# EAGLE schematic MICHA (EAGLE 9.2.2)
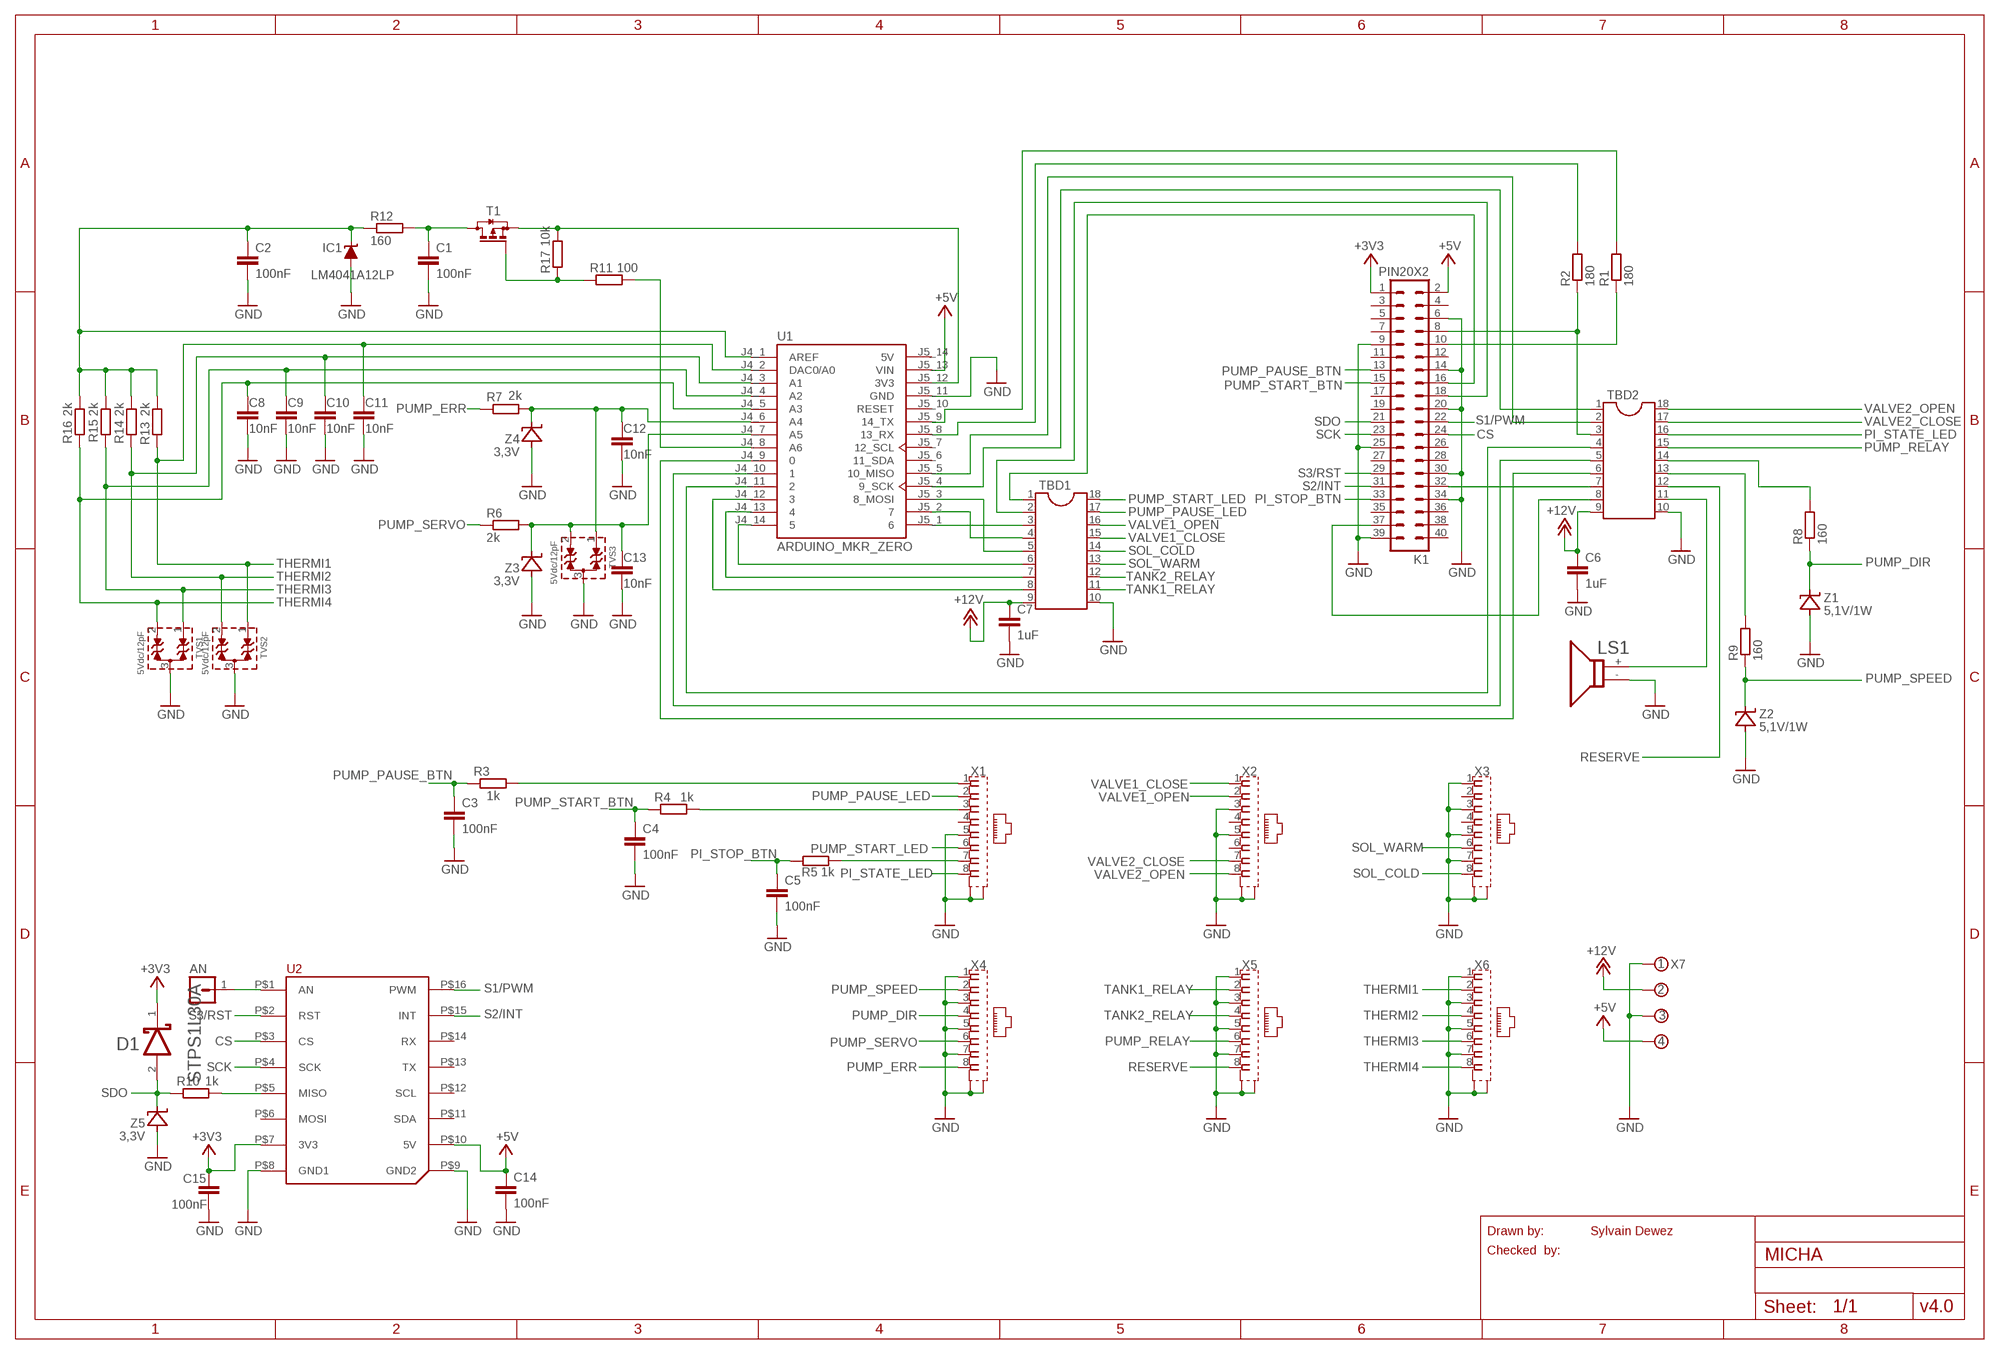
[diagram p0: schematic, sheet 1]

## Parts
AN  MA01_PINHEADER  [MA01]
C1  100nF  C-EUC1206  [C1206]
C2  100nF  C-EUC1206  [C1206]
C3  100nF  C-EUC1206  [C1206]
C4  100nF  C-EUC1206  [C1206]
C5  100nF  C-EUC1206  [C1206]
C6  1uF  C-EUC1206  [C1206]
C7  1uF  C-EUC1206  [C1206]
C8  10nF  C-EUC1206  [C1206]
C9  10nF  C-EUC1206  [C1206]
C10  10nF  C-EUC1206  [C1206]
C11  10nF  C-EUC1206  [C1206]
C12  10nF  C-EUC1206  [C1206]
C13  10nF  C-EUC1206  [C1206]
C14  100nF  C-EUC1206  [C1206]
C15  100nF  C-EUC1206  [C1206]
D1  STMICROELECTRONICS_STPS1L30ASTMICROELECTRONICS_STPS1L30A_0_0  [STMICROELECTRONICS_STPS1L30A_0]
IC1  LM4041A12LP  [LP_O-PBCY-W3]
K1  PIN20X2  [PIN_20X2]
LS1  RSPRO-BUZZER-7800743  [RSPRO-BUZZER-7800743]
R1  180  R-EU_R1206  [R1206]
R2  180  R-EU_R1206  [R1206]
R3  1k  R-EU_R1206  [R1206]
R4  1k  R-EU_R1206  [R1206]
R5  1k  R-EU_R1206  [R1206]
R6  2k  R-EU_R1206  [R1206]
R7  2k  R-EU_R1206  [R1206]
R8  160  R-EU_R1210  [R1210]
R9  160  R-EU_R1210  [R1210]
R10  1k  R-EU_R1206  [R1206]
R11  100  R-EU_R1206  [R1206]
R12  160  R-EU_R1210  [R1210]
R13  2k  R-EU_R1206  [R1206]
R14  2k  R-EU_R1206  [R1206]
R15  2k  R-EU_R1206  [R1206]
R16  2k  R-EU_R1206  [R1206]
R17  10k  R-EU_R1206  [R1206]
T1  BSS84  [SOT23]
TBD1  DIL18S  [SOCKET-18]
TBD2  DIL18S  [SOCKET-18]
TVS1  5Vdc/12pF  WE-TVS_SOT23-3L_824022  [WE-TVS_SOT23-3L]
TVS2  5Vdc/12pF  WE-TVS_SOT23-3L_824022  [WE-TVS_SOT23-3L]
TVS3  5Vdc/12pF  WE-TVS_SOT23-3L_824022  [WE-TVS_SOT23-3L]
U1  ARDUINO_MKR_ZERO  [MODULE_ARDUINO_MKR_ZERO]
U2  MIKROE_CLICK  [MIKROE_BUS_MIDI_NOLABEL]
X1  RJ45-RJULE4318101  [RJ45-RJULE4318101]
X2  RJ45-RJULE4318101  [RJ45-RJULE4318101]
X3  RJ45-RJULE4318101  [RJ45-RJULE4318101]
X4  RJ45-RJULE4318101  [RJ45-RJULE4318101]
X5  RJ45-RJULE4318101  [RJ45-RJULE4318101]
X6  RJ45-RJULE4318101  [RJ45-RJULE4318101]
X7  BUCHANAN_4_3.5MM  [BUCHANAN_4_3.5MM]
Z1  5,1V/1W  ZENER_SMA  [ZENER_SMA]
Z2  5,1V/1W  ZENER_SMA  [ZENER_SMA]
Z3  3,3V  ZENER_SMA  [ZENER_SMA]
Z4  3,3V  ZENER_SMA  [ZENER_SMA]
Z5  3,3V  ZENER_SMA  [ZENER_SMA]

## Nets
+3V3: C15.1 D1.1(CATHODE) K1.1 U2.P$7(3V3)
+5V: C14.1 K1.2 U1.J5_13(VIN) U2.P$10(5V) X7.4(KL3)
+12V: C6.1 C7.1 TBD1.9 TBD2.9 X7.2(KL1)
AN: AN.1 U2.P$1(AN)
CS: K1.24 U2.P$3(CS)
D0: TBD2.6 U1.J4_9
D1: TBD2.5 U1.J4_10
D2: TBD2.4 U1.J4_11
D3: TBD1.8 U1.J4_12
D4: TBD1.7 U1.J4_13
D5: TBD1.6 U1.J4_14
D6: TBD1.3 U1.J5_1
D7: TBD1.4 U1.J5_2
D8: TBD1.5 U1.J5_3(8_MOSI)
D9: TBD2.1 U1.J5_4(9_SCK)
D10: TBD2.2 U1.J5_5(10_MISO)
D19: C12.1 R7.2 TVS3.1(I/O1) U1.J4_6(A4) Z4.C
D21: R11.2 U1.J4_8(A6)
GND: C1.2 C2.2 C3.2 C4.2 C5.2 C6.2 C7.2 C8.2 C9.2 C10.2 C11.2 C12.2 C13.2 C14.2 C15.2 IC1.3(A) K1.6 K1.9 K1.14 K1.20 K1.25 K1.30 K1.34 K1.39 LS1.- TBD1.10 TBD2.10 TVS1.3(GND) TVS2.3(GND) TVS3.3(GND) U1.J5_11(GND) U2.P$8(GND1) U2.P$9(GND2) X1.5 X1.GND1 X1.GND2 X2.3 X2.5 X2.GND1 X2.GND2 X3.1 X3.3 X3.5 X3.7 X3.GND1 X3.GND2 X4.1 X4.3 X4.5 X4.7 X4.GND1 X4.GND2 X5.1 X5.3 X5.5 X5.7 X5.GND1 X5.GND2 X6.1 X6.3 X6.5 X6.7 X6.GND1 X6.GND2 X7.1(KL) X7.3(KL2) Z1.A Z2.A Z3.A Z4.A Z5.A
MISO: R10.2 U2.P$5(MISO)
N$1: R17.2 T1.2(S) U1.J5_12(3V3)
N$2: R8.2 TBD2.14
N$3: R11.1 R17.1 T1.1(G)
N$4: R9.2 TBD2.13
N$5: R4.2 X1.3
N$6: C2.1 IC1.2(C) R12.1 R13.1 R14.1 R15.1 R16.1 U1.J4_1(AREF)
N$14: C13.1 R6.2 TVS3.2(I/O2) U1.J4_7(A5) Z3.C
N$20: C1.1 R12.2 T1.3(D)
N$23: R3.2 X1.1
N$24: R5.2 X1.7
N$26: LS1.+ TBD2.11
PI16: K1.16 TBD1.1
PI18: K1.18 TBD1.2
PI32: K1.32 TBD2.7
PI33: K1.37 TBD2.8
PI_STATE_LED: TBD2.16 X1.8
PI_STOP_BTN: C5.1 K1.33 R5.1
PUMP_DIR: R8.1 X4.4 Z1.C
PUMP_ERR: R7.1 X4.8
PUMP_PAUSE_BTN: C3.1 K1.13 R3.1
PUMP_PAUSE_LED: TBD1.17 X1.2
PUMP_RELAY: TBD2.15 X5.6
PUMP_SERVO: R6.1 X4.6
PUMP_SPEED: R9.1 X4.2 Z2.C
PUMP_START_BTN: C4.1 K1.15 R4.1
PUMP_START_LED: TBD1.18 X1.6
RESERVE: TBD2.12 X5.8
RX_A: R2.2 U1.J5_8(13_RX)
RX_PI: K1.10 R1.1
S1/PWM: K1.22 U2.P$16(PWM)
S2/INT: K1.31 U2.P$15(INT)
S3/RST: K1.29 U2.P$2(RST)
SCK: K1.23 U2.P$4(SCK)
SDO: D1.2(ANODE) K1.21 R10.1 Z5.C
SOL_COLD: TBD1.14 X3.8
SOL_WARM: TBD1.13 X3.6
TANK1_RELAY: TBD1.11 X5.2
TANK2_RELAY: TBD1.12 X5.4
THERMI1: C11.1 R13.2 TVS2.1(I/O1) U1.J4_2(DAC0/A0) X6.2
THERMI2: C10.1 R14.2 TVS2.2(I/O2) U1.J4_3(A1) X6.4
THERMI3: C9.1 R15.2 TVS1.1(I/O1) U1.J4_4(A2) X6.6
THERMI4: C8.1 R16.2 TVS1.2(I/O2) U1.J4_5(A3) X6.8
TX_A: R1.2 U1.J5_9(14_TX)
TX_PI: K1.8 R2.1 TBD2.3
VALVE1_CLOSE: TBD1.15 X2.1
VALVE1_OPEN: TBD1.16 X2.2
VALVE2_CLOSE: TBD2.17 X2.7
VALVE2_OPEN: TBD2.18 X2.8
Unconnected: K1.3 K1.4 K1.5 K1.7 K1.11 K1.12 K1.17 K1.19 K1.26 K1.27 K1.28 K1.35 K1.36 K1.38 K1.40 U1.J5_6(11_SDA) U1.J5_7(12_SCL) U1.J5_10(RESET) U2.P$6(MOSI) U2.P$11(SDA) U2.P$12(SCL) U2.P$13(TX) U2.P$14(RX) X1.4 X2.4 X2.6 X3.2 X3.4

## Notes on the sheet
- Drawn by: | Sylvain Dewez
- Checked  by:
- v4.0

## Power pins joined to a net without a drawn wire
5V: U1.J5_14(5V)

## Library data of the parts
AN = MA01_pinHeader:MA01_PINHEADER
C1-C15 = rcl:C-EU: CAPACITOR, European symbol; SPICEPREFIX: C
D1 = Diode_STPS1L30A:STMICROELECTRONICS_STPS1L30A: LOW DROP POWER SCHOTTKY RECTIFIER; CENTROID_NOT_SPECIFIED: No; DATASHEET: http://www.st.com/content/ccc/resource/technical/document/datasheet/d4/83/f4/ff/dc/cc/48/7f/CD00001323.pdf/files/CD00001323.pdf/jcr:content/translations/en.CD00001323.pdf; DIGIKEY_DESCRIPTION: DIODE SCHOTTKY 30V 1A SMA; DIGIKEY_PART_NUMBER: 497-6577-1-ND; LEAD_FREE: yes; MF: STMicroelectronics; MOUSER_PART_NUMBER: 511-STPS1L30A; MPN: STPS1L30A; PACKAGE: DO-214AC; PREFIX: D; ROHS: yes; TEMPERATURE_RANGE_HIGH: +150°C
IC1 = texas:LM4041: PRECISION MICROPOWER SHUNT VOLTAGE REFERENCE Source: http://focus.ti.com/lit/ds/slcs146e/slcs146e.pdf; OC_FARNELL: 9486119; OC_NEWARK: unknown
K1 = FLYFISH:PIN20X2
LS1 = RSpro-buzzer-7800743:RSPRO-BUZZER-7800743: Rs pro piezo buzzer 780-0743 Diamètre: 16 mm Hauteur: 14,5 mm Empattement: 7,6 mm Diamètre trou: 0,7 mm Tension de fonctionnement: 9-15 V Courant de fonctionnement: 40 mA Résistance: 115 ohms Référence: 780-0743 Datasheet: https://docs.rs-online.com/ff3f/0900766b81582bd9.pdf
R1-R7 R10 R11 R13-R17 = resistor:R-EU_: RESISTOR, European symbol
R8 R9 R12 = rcl:R-EU_: RESISTOR, European symbol; SPICEPREFIX: R
T1 = transistor-small-signal:BSS84: P-CHANNEL MOS FET
TBD1 TBD2 = ic-package:DIL18: Dual In Line / Socket
TVS1-TVS3 = EMCComponents (rev19b):WE-TVS_SOT23-3L_824022: WE-TVS TVS Diode – Standard Series Characteristics Fast turn-on Low clamping voltage High ESD withstand voltage Uni- or bidirectional protection Small package Epoxy flame resistant UL94 V-0 Applications DC power supply USB Power Delivery (PD) Headsets and accessories PDAs Digital cameras MP3-Player Touch Panels Notebooks ESD, EFT and Surge Protection ESD protection in accordance with EN 61000-4-2 – 8 kV contact discharge – 15 kV air discharge Application Notes ANP024 The USB Interface from EMC Point of View <https://katalog.we-online.de/media/images/v2/Family_WE-TVS_Standard.jpg> Details see: https://katalog.we-online.de/en/pbs/WE-TVS/82402374?m Updated by Dan Xu 2014-07-11 2014 (C) Wurth Elektronik; WE-NUMBER: 824022
U1 = ARDUINO_MKR_ZERO:ARDUINO_MKR_ZERO: ATSAMD21 Arduino MKR Zero with Headers SAM D ARM® Cortex®-M0+ MCU 32-Bit Embedded Evaluation Board; AVAILABILITY: Unavailable; DESCRIPTION: ATSAMD21 Arduino MKR Zero with Headers SAM D ARM® Cortex®-M0+ MCU 32-Bit Embedded Evaluation Board; MF: Arduino; MP: ARDUINO MKR ZERO; PACKAGE: None; PRICE: None
U2 = mikrobus_lib:MIKROE_CLICK
X1-X6 = con-amphenol-rj45-ld:RJ45-RJULE4318101: RJ45 shielded socket Naming: Amphenol RJULE4318101 Mouser 523-RJULE4318101 Seller: https://eu.mouser.com/ProductDetail/amphenol/rjule4318101/?qs=ToP8pWlZ0bN94UmIrj8tlQ==&countrycode=DE&currencycode=EUR Datasheet: https://eu.mouser.com/datasheet/2/18/Amphenol_RJULE_BRO-1157177.pdf
X7 = con-TEconnectivity:BUCHANAN_4_3.5MM
Z1-Z5 = Zener_SMA:ZENER_SMA